# Altium schematic sheet Industrial-Controller_Relay.SchDoc: Relays
size 279 x 215 mm; Date: not used; ApprovedBy: not used; CheckedBy: not used; Author: not used; DrawnBy: not used; Organization: not used; Address4: not used; SheetNumber: 6; SheetTotal: 21; Time: not used; ImagePath: not used; Application_BuildNumber: not used
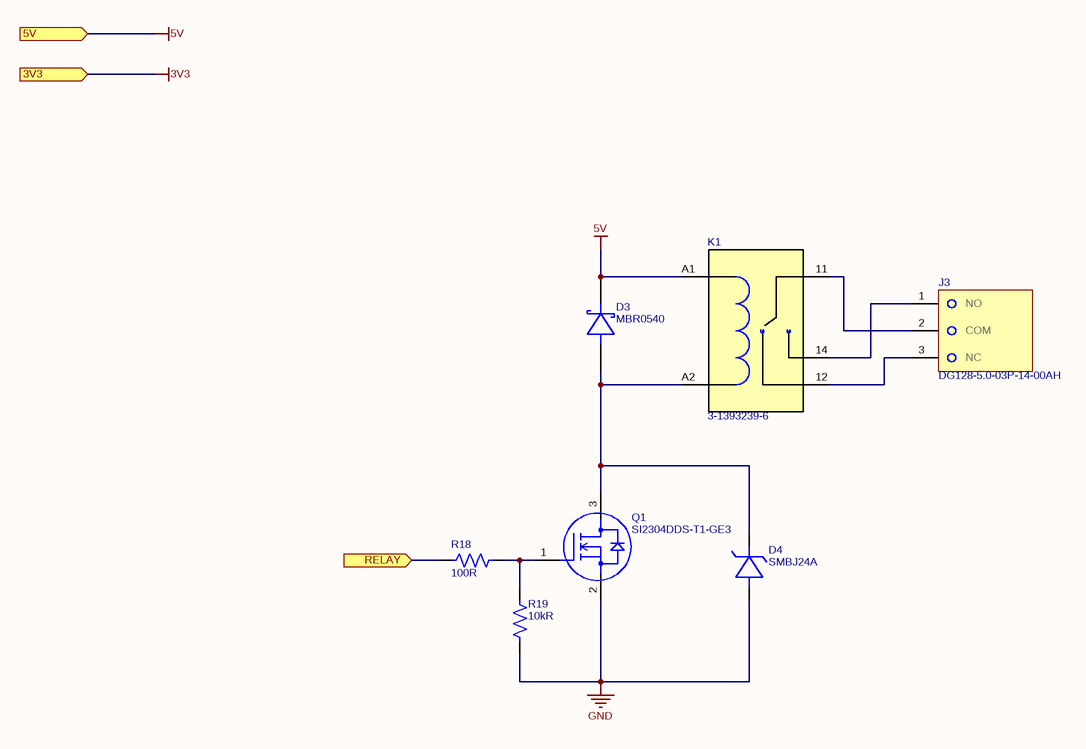
[diagram p0: Industrial-Controller_Relay.SchDoc]

## Parts
D3  MBR0540  [SOD-123]
D4  SMBJ24A  [SMB]
J3  DG128-5.0-03P-14-00AH  [DG128-5.0-03P-14]
K1  3-1393239-6  [3-1393239-6]
Q1  SI2304DDS-T1-GE3  [SOT-23-3]
R18  100R  [RES_0603]
R19  10kR  [RES_0603]

## Ports
3V3 (in), 5V (in), RELAY (in)

## Nets
3V3: port 3V3
5V: D3.1(C) K1.A1 ; port 5V
GND: D4.2(A) Q1.2(S) R19.2
RELAY: R18.1 ; port RELAY
NetD3_2: D3.2(A) D4.1(C) K1.A2 Q1.3(D)
NetJ3_1: J3.1 K1.14(NO)
NetJ3_2: J3.2 K1.11(COM)
NetJ3_3: J3.3 K1.12(NC)
NetQ1_1: Q1.1(G) R18.2 R19.1

## Notes on the sheet
- Title:
- Date:
- Size A
- Project:
- Number:
- Time:
- Sheet
- Revision
- of
- Engineer:
- www.mrobots.ru <http://mrobots.ru/>
- File:

## Library data of the parts
D3 = MBR0540: DIODE SCHOTTKY 40V 500MA SOD123; Manufacturer: ON Semiconductor / Fairchild; Max Reverse Current: 20uA; Forward Voltage: 620mV; Peak Non-Repetitive Surge Current: 5.5A; Element Configuration: Single; Polarity: Standard; Current Rating: 500A; Power Dissipation: 400mW; Supplier 1: Arrow Electronics; Manufacturer Part Number: MBR0540; RoHS: Yes; Category: Schottky Diodes; Stock 1: 1; Pricing 1: 1=0,10130, 10=0,09370, 25=0,08240, 50=0,07560, 100=0,06800, 500=0,06720 (USD); Mount: Surface Mount; Number of Pins: 2; Contact Plating: Tin,Matte; Weight: 0.03g; Min Operating Temperature: -65°C; Max Operating Temperature: 125°C; Forward Current: 500mA; Package Quantity: 3000; Packaging: Tape and Reel; Average Rectified Current: 500mA; Max Repetitive Reverse Voltage (Vrrm): 40V; Max Forward Surge Current (Ifsm): 5.5A; Voltage Rating (DC): 40V; Output Current: 500mA; Max Reverse Voltage (DC): 40V; Max Surge Current: 5.5A; Max Reverse Leakage Current: 20uA; Length: 2.7mm; Width: 1.6mm; Height: 1.03mm; Radiation Hardening: No; Lead Free: Lead Free; RoHS Compliant: Yes; REACH SVHC: No SVHC; ComponentLink1URL: https://datasheet.ciiva.com/4713/mbr0540-90522-4713942.pdf?src-supplier=Mouser; ComponentLink1Description: https://datasheet.ciiva.com/4713/mbr0540-90522-4713942.pdf?src-supplier=Mouser; ComponentLink2URL: https://datasheet.ciiva.com/34301/975060-34301827.pdf?src-supplier=Jameco; ComponentLink2Description: https://datasheet.ciiva.com/34301/975060-34301827.pdf?src-supplier=Jameco; ComponentLink3URL: https://datasheet.ciiva.com/26943/getdatasheetpartid-110131-26943450.pdf?src-supplier=Verical; ComponentLink3Description: https://datasheet.ciiva.com/26943/getdatasheetpartid-110131-26943450.pdf?src-supplier=Verical; ComponentLink4URL: https://datasheet.ciiva.com/46428/1868854-46428603.pdf?src-supplier=Element14; ComponentLink4Description: https://datasheet.ciiva.com/46428/1868854-46428603.pdf?src-supplier=Element14; ComponentLink5URL: https://datasheet.ciiva.com/8303/mbr0540-8303805.pdf?src-supplier=Avnet; ComponentLink5Description: https://datasheet.ciiva.com/8303/mbr0540-8303805.pdf?src-supplier=Avnet; ComponentLink6URL: https://datasheet.ciiva.com/918/mbr0540-918355.pdf?src-supplier=Digi-Key; ComponentLink6Description: https://datasheet.ciiva.com/918/mbr0540-918355.pdf?src-supplier=Digi-Key; ComponentLink7URL: https://datasheet.ciiva.com/918/mbr0540-918356.pdf?src-supplier=Digi-Key; ComponentLink7Description: https://datasheet.ciiva.com/918/mbr0540-918356.pdf?src-supplier=Digi-Key; ComponentLink8URL: https://datasheet.ciiva.com/918/mbr0540-918354.pdf?src-supplier=Digi-Key; ComponentLink8Description: https://datasheet.ciiva.com/918/mbr0540-918354.pdf?src-supplier=Digi-Key; Supplier Part Number 1: MBR0540; Manufacturer 1: ON Semiconductor / Fairchild; Manufacturer Part Number 1: MBR0540
D4 = SMBJ24A: TVS DIODE 24VWM 38.9VC SMB; Manufacturer 1: Bourns; Direction: Unidirectional; Number of Elements: 1; Reverse Breakdown Voltage: 26.7V; Max Surge Current: 100A; Reverse Standoff Voltage: 24V; Clamping Voltage: 38.9V; Peak Pulse Power: 600W; Power Line Protection: No; Breakdown Voltage: 30.7V; Max Reverse Leakage Current: 5uA; Test Current: 1mA; Peak Pulse Current: 15.4A; Element Configuration: Single; Diode Type: ZENER; Operating Supply Voltage: 3.5V; ESD Protection: Yes; ComponentLink6URL: https://datasheet.ciiva.com/330/littelfuse-tvs-diode-smaj-datasheet-pdf-330796.pdf?src-supplier=Digi-Key; ComponentLink6Description: https://datasheet.ciiva.com/330/littelfuse-tvs-diode-smaj-datasheet-pdf-330796.pdf?src-supplier=Digi-Key; Supplier 1: Arrow Electronics; RoHS: Yes; Category: TVS Diodes; Stock 1: 14; Pricing 1: 1=0,52680, 10=0,35320 (USD); Mount: Surface Mount; Case/Package: SMB; Number of Pins: 2; Min Operating Temperature: -55°C; Max Operating Temperature: 150°C; Packaging: Tape and Reel; Package Quantity: 1; Number of Unidirectional Channels: 1; Min Breakdown Voltage: 26.7V; Polarity: Unidirectional; Termination: SMD/SMT; Max Breakdown Voltage: 30.7V; Max Power Dissipation: 600W; Leakage Current: 5uA; Resistor Type: Zener; Series: SMBJ; Number of Channels: 1; Length: 4.57mm; Width: 3.94mm; Height: 2.42mm; Radiation Hardening: No; RoHS Compliant: Yes; REACH SVHC: No SVHC; ComponentLink1URL: https://datasheet.ciiva.com/30478/0900766b81189a19-30478832.pdf?src-supplier=RSComponents; ComponentLink1Description: https://datasheet.ciiva.com/30478/0900766b81189a19-30478832.pdf?src-supplier=RSComponents; ComponentLink2URL: https://datasheet.ciiva.com/3022/smbj-3022496.pdf?src-supplier=Avnet; ComponentLink2Description: https://datasheet.ciiva.com/3022/smbj-3022496.pdf?src-supplier=Avnet; ComponentLink3URL: https://datasheet.ciiva.com/3022/smbj-3022497.pdf?src-supplier=Avnet; ComponentLink3Description: https://datasheet.ciiva.com/3022/smbj-3022497.pdf?src-supplier=Avnet; ComponentLink4URL: https://datasheet.ciiva.com/342/smbj-342022.pdf?src-supplier=Digi-Key; ComponentLink4Description: https://datasheet.ciiva.com/342/smbj-342022.pdf?src-supplier=Digi-Key; ComponentLink5URL: https://datasheet.ciiva.com/8031/1677318-8031064.pdf?src-supplier=Element14; ComponentLink5Description: https://datasheet.ciiva.com/8031/1677318-8031064.pdf?src-supplier=Element14; ComponentLink7URL: https://datasheet.ciiva.com/28410/1677318-28410012.pdf?src-supplier=Element14; ComponentLink7Description: https://datasheet.ciiva.com/28410/1677318-28410012.pdf?src-supplier=Element14; ComponentLink8URL: https://datasheet.ciiva.com/342/smbj-342020.pdf?src-supplier=Digi-Key; ComponentLink8Description: https://datasheet.ciiva.com/342/smbj-342020.pdf?src-supplier=Digi-Key; ComponentLink9URL: https://datasheet.ciiva.com/342/smbj-342021.pdf?src-supplier=Digi-Key; ComponentLink9Description: https://datasheet.ciiva.com/342/smbj-342021.pdf?src-supplier=Digi-Key; ComponentLink10URL: https://datasheet.ciiva.com/16237/smbj-16237468.pdf?src-supplier=Onlinecomponents.com; ComponentLink10Description: https://datasheet.ciiva.com/16237/smbj-16237468.pdf?src-supplier=Onlinecomponents.com; ComponentLink11URL: https://datasheet.ciiva.com/48712/001056314-da-01-en-tvs-diode-smbj24a-do-214aa-bou-48712566.pdf?src-supplier=Conrad; ComponentLink11Description: https://datasheet.ciiva.com/48712/001056314-da-01-en-tvs-diode-smbj24a-do-214aa-bou-48712566.pdf?src-supplier=Conrad; Supplier Part Number 1: SMBJ24A; Manufacturer Part Number 1: SMBJ24A
J3 = DG128-5.0-03P-14: TERM BLK 3P TOP ENTRY 5MM SMD; Manufacturer 1: Degson; Number of Contacts: 3; Stripping Length: 7mm; Contact_1: NO; Contact_2: COM; Contact_3: NC; Category: Uncategorized; Color: Green; Contact Material: Brass,Tin; Height: 17.6mm; Length: 10.2mm; Mount: Screw; Pitch: 5mm; Weight: 4g; Width: 15mm; Manufacturer Part Number 1: DG128-5.0-03P-14-00AH
K1 = 3-1393239-6: RELAY GEN PURPOSE SPDT 10A 5V; Manufacturer 1: TE Connectivity Schrack; Supplier 1: Arrow Electronics; RoHS: Yes; Category: Signal Relays; Stock 1: 3333; Pricing 1: 1=1,30120 (USD); ComponentLink1URL: https://datasheet.ciiva.com/2409/eng-ds-rt1-sensitive-0910-2409155.pdf?src-supplier=Avnet; ComponentLink1Description: https://datasheet.ciiva.com/2409/eng-ds-rt1-sensitive-0910-2409155.pdf?src-supplier=Avnet; ComponentLink2URL: https://datasheet.ciiva.com/14146/rt1sens-eng-datasheet-14146563.pdf?src-supplier=Distrelec; ComponentLink2Description: https://datasheet.ciiva.com/14146/rt1sens-eng-datasheet-14146563.pdf?src-supplier=Distrelec; ComponentLink3URL: https://datasheet.ciiva.com/16307/3-1393239-6-16307647.pdf?src-supplier=Future+Electronics; ComponentLink3Description: https://datasheet.ciiva.com/16307/3-1393239-6-16307647.pdf?src-supplier=Future+Electronics; ComponentLink4URL: https://datasheet.ciiva.com/14190/eng-ds-rt1-sensitive-0411-14190113.pdf?src-supplier=Avnet; ComponentLink4Description: https://datasheet.ciiva.com/14190/eng-ds-rt1-sensitive-0411-14190113.pdf?src-supplier=Avnet; ComponentLink5URL: https://datasheet.ciiva.com/30127/eng-ds-rt1-sensitive-0411-30127511.pdf?src-supplier=Onlinecomponents.com; ComponentLink5Description: https://datasheet.ciiva.com/30127/eng-ds-rt1-sensitive-0411-30127511.pdf?src-supplier=Onlinecomponents.com; Supplier Part Number 1: RT174005; Manufacturer Part Number 1: 3-1393239-6
Q1 = SI2304DDS-T1-GE3: MOSFET N-CH 30V 3.3A/3.6A SOT23; Manufacturer 1: Vishay Siliconix; Nominal Vgs: 2.2V; Rds On Max: 850mR; Input Capacitance: 35pF; Rise Time: 50ns; Continuous Drain Current (ID): 3.6A; Max Power Dissipation: 200mW; Drain to Source Resistance: 49mR; Number of Elements: 1; Power Dissipation: 1.1W; Turn-Off Delay Time: 12ns; Fall Time: 22ns; Element Configuration: Single; Gate to Source Voltage (Vgs): 20V; On-State Resistance: 60mR; Polarity: N-CHANNEL; Supplier 1: Digi-Key; Manufacturer Part Number 1: SI2304DDS-T1-GE3; RoHS: Yes; Category: MOSFETs; Stock 1: 5879; Pricing 1: 1=0,45000, 10=0,36200, 100=0,24640, 500=0,18480, 1000=0,13860 (USD); Mount: Surface Mount; Case/Package: SOT-23-3; Number of Pins: 3; Weight: 0.050717oz; Contact Plating: Tin,Matte; Min Operating Temperature: -55°C; Max Operating Temperature: 150°C; Packaging: Tape and Reel; Package Quantity: 3000; Drain to Source Voltage (Vdss): 30V; Drain to Source Breakdown Voltage: 30V; Threshold Voltage: 2.2V; Turn-On Delay Time: 12ns; Number of Channels: 1; Series: TrenchFET®; Drain-source On Resistance-Max: 60mR; Radiation Hardening: No; REACH SVHC: No SVHC; Lead Free: Lead Free; RoHS Compliant: Yes; ComponentLink1URL: https://datasheet.ciiva.com/5769/si2304dd-5769090.pdf?src-supplier=Farnell; ComponentLink1Description: https://datasheet.ciiva.com/5769/si2304dd-5769090.pdf?src-supplier=Farnell; ComponentLink2URL: https://datasheet.ciiva.com/7370/1750671-7370955.pdf?src-supplier=Newark; ComponentLink2Description: https://datasheet.ciiva.com/7370/1750671-7370955.pdf?src-supplier=Newark; ComponentLink3URL: https://datasheet.ciiva.com/4441/si2304dd-244438-4441695.pdf?src-supplier=Mouser; ComponentLink3Description: https://datasheet.ciiva.com/4441/si2304dd-244438-4441695.pdf?src-supplier=Mouser; ComponentLink4URL: https://datasheet.ciiva.com/2957/si2304dd-2957371.pdf?src-supplier=Digi-Key; ComponentLink4Description: https://datasheet.ciiva.com/2957/si2304dd-2957371.pdf?src-supplier=Digi-Key; ComponentLink5URL: https://datasheet.ciiva.com/7788/si2304dd-7788750.pdf?src-supplier=Element14; ComponentLink5Description: https://datasheet.ciiva.com/7788/si2304dd-7788750.pdf?src-supplier=Element14; ComponentLink6URL: https://datasheet.ciiva.com/8115/si2304dd-8115070.pdf?src-supplier=Avnet; ComponentLink6Description: https://datasheet.ciiva.com/8115/si2304dd-8115070.pdf?src-supplier=Avnet; ComponentLink7URL: https://datasheet.ciiva.com/2957/si2304dd-2957372.pdf?src-supplier=Digi-Key; ComponentLink7Description: https://datasheet.ciiva.com/2957/si2304dd-2957372.pdf?src-supplier=Digi-Key; ComponentLink8URL: https://datasheet.ciiva.com/26137/si2304dd-26137837.pdf?src-supplier=Avnet+Europe; ComponentLink8Description: https://datasheet.ciiva.com/26137/si2304dd-26137837.pdf?src-supplier=Avnet+Europe; Supplier Part Number 1: SI2304DDS-T1-GE3CT-ND
R18 = RC0603FR-07100RL: RES 100 OHM 1% 1/10W 0603; Manufacturer 1: Yageo; Voltage Rating (DC): 50V; Temperature Coefficient: 100ppm/°C; Power Rating: 100mW; Supplier 1: Arrow Electronics; RoHS: Yes; Category: Chip SMD Resistors; Stock 1: 17580000; Pricing 1: 5000=0,00180 (USD); Case/Package: 0603; Number of Pins: 2; Case Code (Imperial): 0603; Case Code (Metric): 1608; Size Code: 0603; Min Operating Temperature: -55°C; Max Operating Temperature: 155°C; Resistance: 100R; Tolerance: 1%; Packaging: Tape and Reel; Resistor Type: Thick Film; Voltage Rating: 50V; Termination: SMD/SMT; Features: Moisture Resistant; Series: RC; Max Power Dissipation: 100mW; Number of Terminations: 2; Construction: Rectangular; Resistance Tolerance: 1%; Technology: THICK FILM; Length: 1.6mm; Width: 0.8mm; Height: 0.45mm; Depth: 0.8mm; REACH SVHC: Unknown; Lead Free: Lead Free; Military Standard: Not; RoHS Compliant: Yes; Supplier Part Number 1: RC0603FR-07100RL; Manufacturer Part Number 1: RC0603FR-07100RL
R19 = RC0603FR-0710KL: RES 10K OHM 1% 1/10W 0603; Manufacturer 1: Yageo; Voltage Rating (DC): 50V; Temperature Coefficient: 100ppm/°C; Power Rating: 100mW; Voltage Rating: 75V; Supplier 1: Arrow Electronics; RoHS: Yes; Category: Chip SMD Resistors; Stock 1: 4950000; Pricing 1: 5000=0,00240 (USD); Case/Package: 0603; Number of Pins: 2; Case Code (Imperial): 0603; Case Code (Metric): 1608; Weight: 7.1E-05oz; Size Code: 0603; Min Operating Temperature: -55°C; Max Operating Temperature: 155°C; Packaging: Tape and Reel; Resistance: 10kR; Tolerance: 1%; Resistor Type: Thick Film; Termination: SMD/SMT; Features: Moisture Resistant; Series: RC; Max Power Dissipation: 100mW; Number of Terminations: 2; Resistance Tolerance: 1%; Construction: Rectangular; Length: 1.6mm; Width: 0.8mm; Height: 0.45mm; Depth: 0.8mm; Lead Pitch: 0.3mm; REACH SVHC: Unknown; Lead Free: Lead Free; Military Standard: Not; RoHS Compliant: Yes; ComponentLink1URL: https://datasheet.ciiva.com/7660/38590-7660789.pdf?src-supplier=Element14; ComponentLink1Description: https://datasheet.ciiva.com/7660/38590-7660789.pdf?src-supplier=Element14; ComponentLink2URL: https://datasheet.ciiva.com/7983/443971-7983596.pdf?src-supplier=Element14; ComponentLink2Description: https://datasheet.ciiva.com/7983/443971-7983596.pdf?src-supplier=Element14; ComponentLink3URL: https://datasheet.ciiva.com/22747/443971-22747519.pdf?src-supplier=Element14; ComponentLink3Description: https://datasheet.ciiva.com/22747/443971-22747519.pdf?src-supplier=Element14; ComponentLink4URL: https://datasheet.ciiva.com/46440/1868787-46440891.pdf?src-supplier=Element14; ComponentLink4Description: https://datasheet.ciiva.com/46440/1868787-46440891.pdf?src-supplier=Element14; ComponentLink5URL: https://datasheet.ciiva.com/7746/1738695-7746239.pdf?src-supplier=Element14; ComponentLink5Description: https://datasheet.ciiva.com/7746/1738695-7746239.pdf?src-supplier=Element14; Supplier Part Number 1: RC0603FR-0710KL; Manufacturer Part Number 1: RC0603FR-0710KL